# EAGLE schematic ExploraRoverRobot_MotorsControllerSystem (EAGLE 9.3.0)
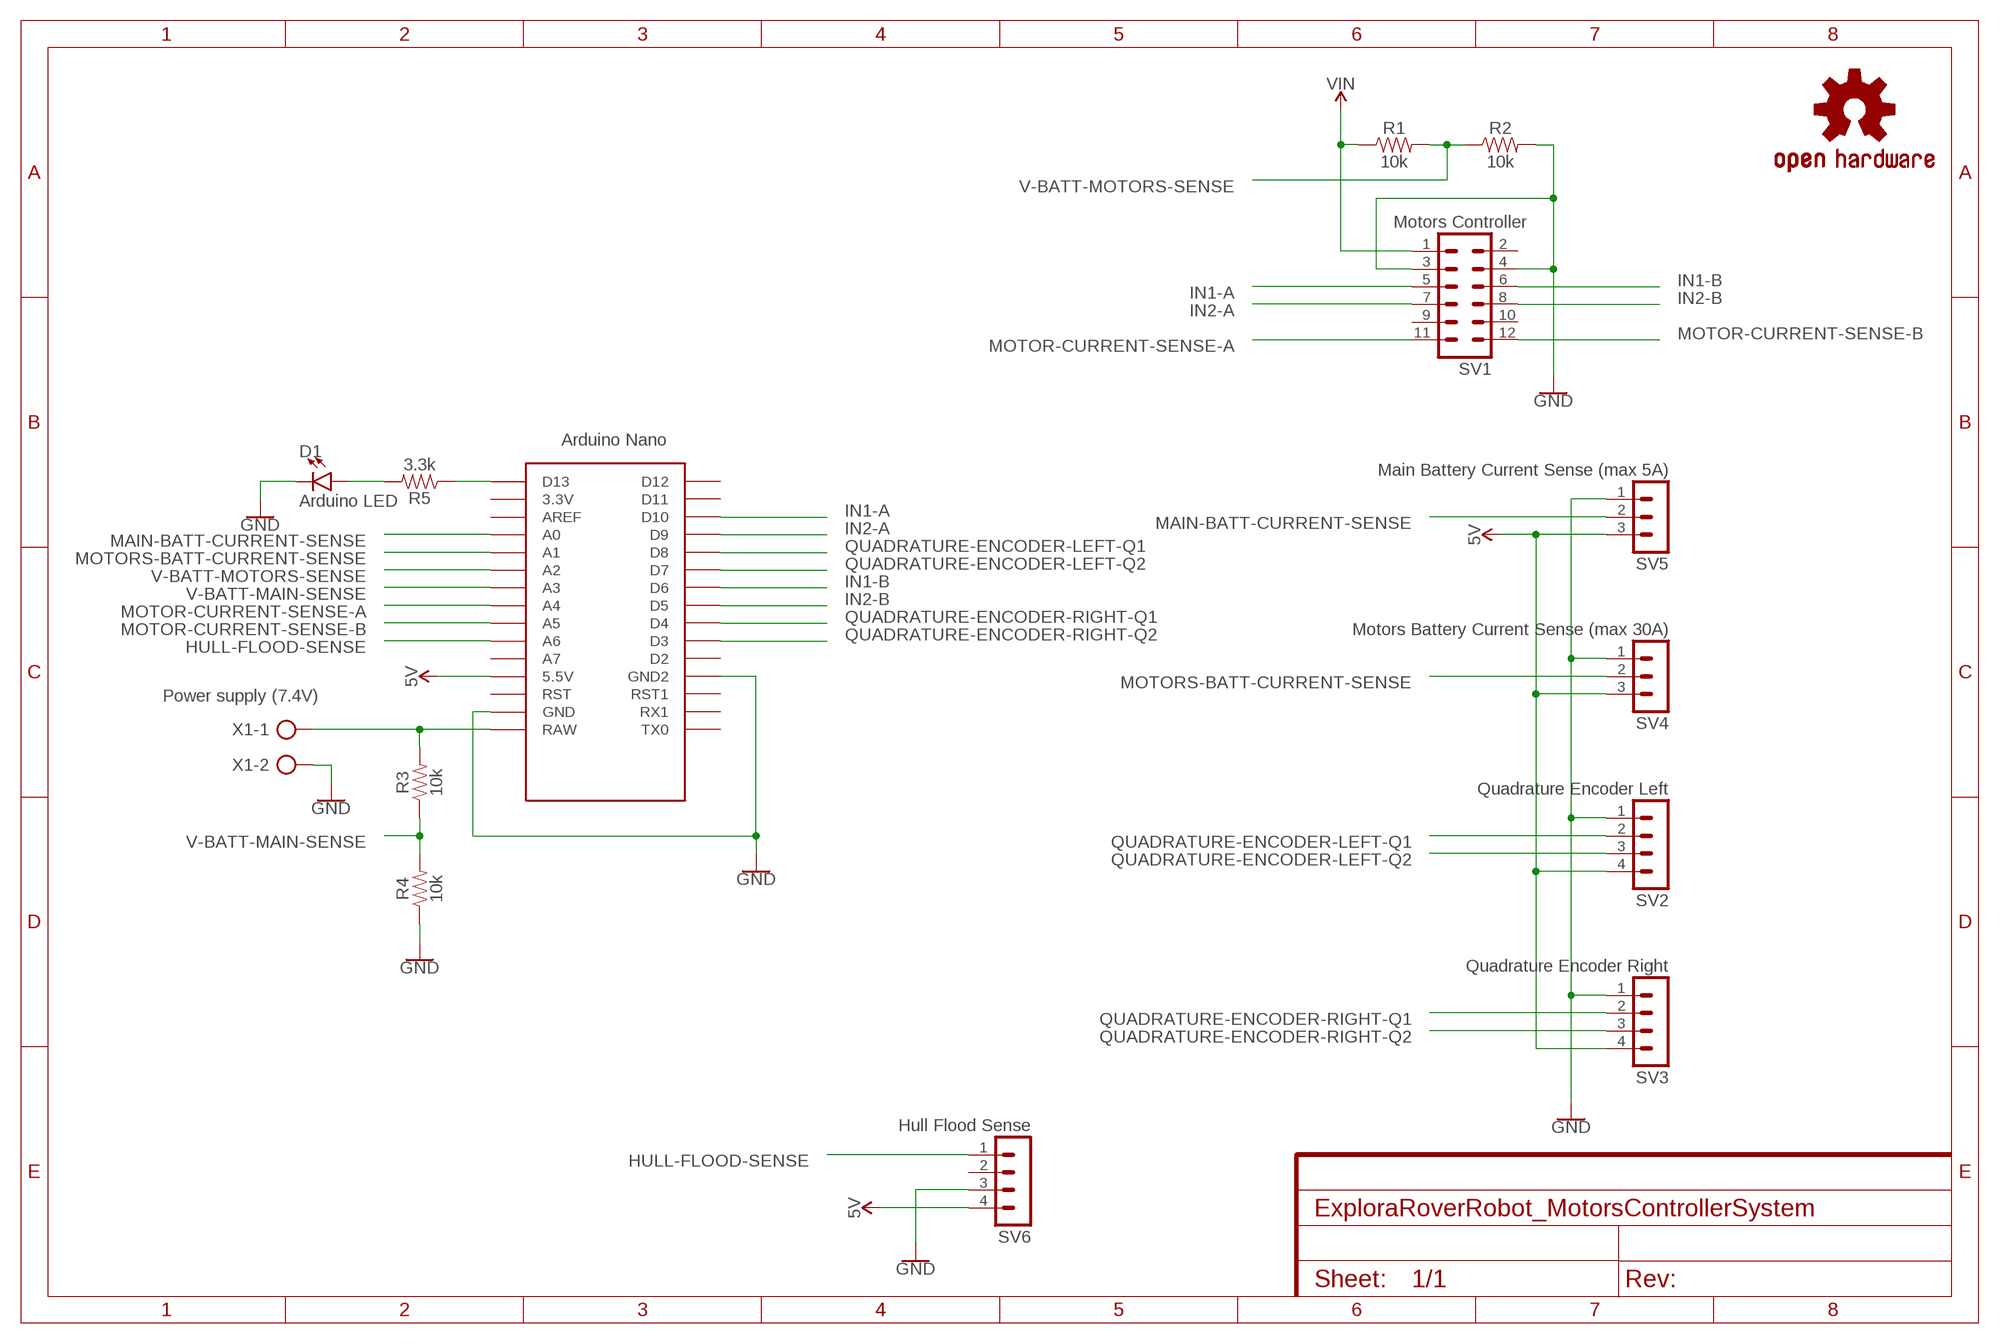
[diagram p0: schematic, sheet 1]

## Parts
D1  Arduino LED  LED3MM  [LED_3MM]
LOGO1  OSHW-LOGOL  [OSHW-LOGO-L]
R1  10k  10KOHM-0603-1/10W-1%  [0603]
R2  10k  10KOHM-0603-1/10W-1%  [0603]
R3  10k  10KOHM-0603-1/10W-1%  [0603]
R4  10k  10KOHM-0603-1/10W-1%  [0603]
R5  3.3k  10KOHM-0603-1/10W-1%  [0603]
SV1  Motors Controller  MA06-2  [MA06-2]
SV2  Quadrature Encoder Left  MA04-1  [MA04-1]
SV3  Quadrature Encoder Right  MA04-1  [MA04-1]
SV4  Motors Battery Current Sense (max 30A)  MA03-1  [MA03-1]
SV5  Main Battery Current Sense (max 5A)  MA03-1  [MA03-1]
SV6  Hull Flood Sense  MA04-1  [MA04-1]
U$1  NANO  [NANO]
X1  Power supply (7.4V)  AK500/2  [AK500/2]

## Nets
5V: SV2.4 SV3.4 SV4.3 SV5.3 SV6.4 U$1.5V(5.5V)
GND: D1.K(C) R2.2 R4.1 SV1.3 SV1.4 SV2.1 SV3.1 SV4.1 SV5.1 SV6.3 U$1.GND U$1.GND1(GND2) X1.2
HULL-FLOOD-SENSE: SV6.1 U$1.A6
IN1-A: SV1.5 U$1.D10
IN1-B: SV1.6 U$1.D6
IN2-A: SV1.7 U$1.D9
IN2-B: SV1.8 U$1.D5
MAIN-BATT-CURRENT-SENSE: SV5.2 U$1.A0
MOTOR-CURRENT-SENSE-A: SV1.11 U$1.A4
MOTOR-CURRENT-SENSE-B: SV1.12 U$1.A5
MOTORS-BATT-CURRENT-SENSE: SV4.2 U$1.A1
N$1: R5.1 U$1.D13
N$2: R3.2 U$1.RAW X1.1
N$3: D1.A R5.2
QUADRATURE-ENCODER-LEFT-Q1: SV2.2 U$1.D8
QUADRATURE-ENCODER-LEFT-Q2: SV2.3 U$1.D7
QUADRATURE-ENCODER-RIGHT-Q1: SV3.2 U$1.D4
QUADRATURE-ENCODER-RIGHT-Q2: SV3.3 U$1.D3
V-BATT-MAIN-SENSE: R3.1 R4.2 U$1.A3
V-BATT-MOTORS-SENSE: R1.2 R2.1 U$1.A2
VIN: R1.1 SV1.1
Unconnected: SV1.2 SV1.9 SV1.10 SV6.2 U$1.3.3V U$1.A7 U$1.AREF U$1.D2 U$1.D11 U$1.D12 U$1.ICSP1 U$1.ICSP2 U$1.ICSP3 U$1.ICSP4 U$1.ICSP5 U$1.ICSP6 U$1.RST U$1.RST1 U$1.RX1 U$1.TX0

## Library data of the parts
D1 = SparkFun-LED:LED: LED (Generic) Standard schematic elements and footprints for 5mm, 3mm, 1206, and 0603 sized LEDs. Generic LEDs with no color specified.; PROD_ID: DIO-08794
LOGO1 = SparkFun-Aesthetics:OSHW-LOGO: Open-Source Hardware (OSHW) Logo This logo indicates the piece of hardware it is found on incorporates a OSHW license and/or adheres to the definition of open source hardware found here: http://freedomdefined.org/OSHW
R1-R4 = SparkFun-Resistors:10KOHM: 10kΩ resistor A resistor is a passive two-terminal electrical component that implements electrical resistance as a circuit element. Resistors act to reduce current flow, and, at the same time, act to lower voltage levels within circuits. - Wikipedia; PROD_ID: RES-00824
R5 = SparkFun-Resistors:10KOHM: 10kΩ resistor A resistor is a passive two-terminal electrical component that implements electrical resistance as a circuit element. Resistors act to reduce current flow, and, at the same time, act to lower voltage levels within circuits. - Wikipedia; PROD_ID: RES-00824; VALUE: 10k
SV1 = con-lstb:MA06-2: PIN HEADER; OC_FARNELL: unknown; OC_NEWARK: unknown
SV2 SV3 SV6 = con-lstb:MA04-1: PIN HEADER; OC_FARNELL: unknown; OC_NEWARK: unknown
SV4 SV5 = con-lstb:MA03-1: PIN HEADER; OC_FARNELL: unknown; OC_NEWARK: unknown
U$1 = Arduino-clone:NANO: Arduino Nano
X1 = con-ptr500:AK500/2: CONNECTOR; OC_FARNELL: unknown; OC_NEWARK: unknown